# Altium schematic sheet Main.SchDoc: 203 Matrix - Core
size 320 x 193 mm; Revision: FE V1.0; SheetNumber: 3; SheetTotal: 4
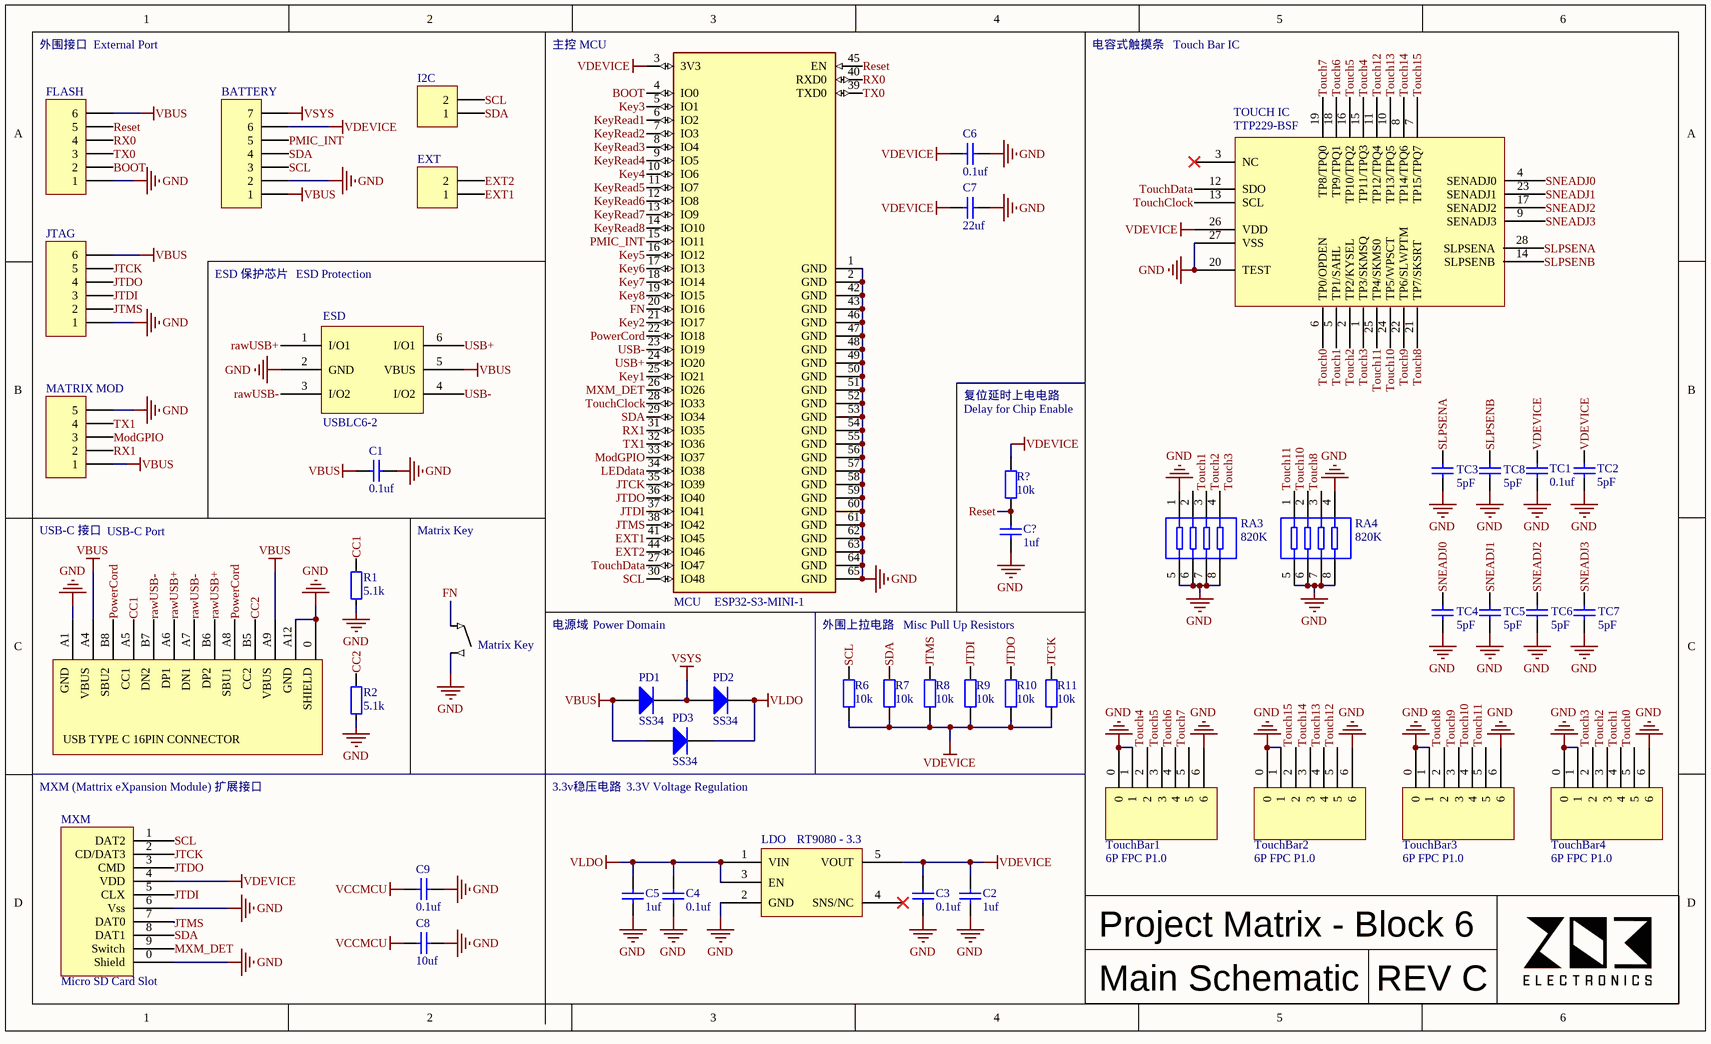
[diagram p0: Main.SchDoc]

## Parts
(Parts that share a designator on the sheet are numbered #1, #2 ... from top to bottom, then left to right.)
BATTERY  (no value)  [HDR1X7]
C1  value 0.1uf  [0603 CAP]  (hidden comment: MCU)
C2  value 1uf  [0603 CAP]  (hidden comment: MCU)
C3  value 0.1uf  [0603 CAP]  (hidden comment: MCU)
C4  value 0.1uf  [0603 CAP]  (hidden comment: MCU)
C5  value 1uf  [0603 CAP]  (hidden comment: MCU)
C6  value 0.1uf  [0603 CAP]  (hidden comment: MCU)
C7  value 22uf  [0603 CAP]  (hidden comment: LDO)
C8  value 10uf  [0603 CAP]  (hidden comment: MCU)
C9  value 0.1uf  [0603 CAP]  (hidden comment: MCU)
C?  value 1uf  [0603 CAP]  (hidden comment: LDO)
ESD  USBLC6-2  [SOT23-6L]
EXT  Header 2  [HDR1X2]  (value not drawn)
I2C  Header 2  [HDR1X2]  (value not drawn)
JTAG#1  FLASH  [HDR1X6]
JTAG#2  Interface to flash ESP  [HDR1X6]  (value not drawn)
LDO  RT9080 - 3.3  [SOT23-5]
Matrix_Key  Comment  [sw5x5]  (value not drawn)
MATRIX_MOD  MHDR1X5  [MHDR1X5]  (value not drawn)
MCU  ESP32-S3-MINI-1  [ESP32-S3-MINI-1]
MXM  Micro SD Card Slot  [TF Slot 2]
PD1  SS34  [SOD123]
PD2  SS34  [SOD123]
PD3  SS34  [SOD123]
R1  value 5.1k  [0603 res]  (hidden comment: MCU)
R2  value 5.1k  [0603 res]  (hidden comment: MCU)
R6  value 10k  [0603 res]  (hidden comment: MCU)
R7  value 10k  [0603 res]  (hidden comment: MCU)
R8  value 10k  [0603 res]  (hidden comment: MCU)
R9  value 10k  [0603 res]  (hidden comment: MCU)
R10  value 10k  [0603 res]  (hidden comment: MCU)
R11  value 10k  [0603 res]  (hidden comment: MCU)
R?  value 10k  [0603 res]  (hidden comment: MCU)
RA3  value 820K  [8P4R]  (hidden comment: Touch Bar)
RA4  value 820K  [8P4R]  (hidden comment: Touch Bar)
TC1  value 0.1uf  [0603 CAP]  (hidden comment: Touch Bar)
TC2  value 5pF  [0603 CAP]  (hidden comment: Touch Bar)
TC3  value 5pF  [0603 CAP]  (hidden comment: Touch Bar)
TC4  value 5pF  [0603 CAP]  (hidden comment: Touch Bar)
TC5  value 5pF  [0603 CAP]  (hidden comment: Touch Bar)
TC6  value 5pF  [0603 CAP]  (hidden comment: Touch Bar)
TC7  value 5pF  [0603 CAP]  (hidden comment: Touch Bar)
TC8  value 5pF  [0603 CAP]  (hidden comment: Touch Bar)
TOUCH_IC  TTP229-BSF  [SSOP-28]
TouchBar1  6P FPC P1.0  [6Pin FPC 1.0mm]
TouchBar2  6P FPC P1.0  [6Pin FPC 1.0mm]
TouchBar3  6P FPC P1.0  [6Pin FPC 1.0mm]
TouchBar4  6P FPC P1.0  [6Pin FPC 1.0mm]
USB-C  USBC 16PIN  [USBC short]  (value not drawn)

## Nets
GND: BATTERY.2 C1.1 C2.1 C3.1 C4.2 C5.2 C6.1 C7.1 C8.2 C9.2 C?.2 ESD.2(GND) JTAG#1.1 JTAG#2.1 LDO.2(GND) Matrix_Key.2(Out) MATRIX_MOD.5 MCU.1(GND) MCU.2(GND) MCU.42(GND) MCU.43(GND) MCU.46(GND) MCU.47(GND) MCU.48(GND) MCU.49(GND) MCU.50(GND) MCU.51(GND) MCU.52(GND) MCU.53(GND) MCU.54(GND) MCU.55(GND) MCU.56(GND) MCU.57(GND) MCU.58(GND) MCU.59(GND) MCU.60(GND) MCU.61(GND) MCU.62(GND) MCU.63(GND) MCU.64(GND) MCU.65(GND) MXM.0(Shield) MXM.6(Vss) R1.2 R2.1 RA3.1 RA3.5 RA3.6 RA3.7 RA3.8 RA4.4 RA4.5 RA4.6 RA4.7 RA4.8 TC1.1 TC2.1 TC3.1 TC4.1 TC5.1 TC6.1 TC7.1 TC8.1 TOUCH_IC.20(TEST) TOUCH_IC.27(VSS) TouchBar1.0 TouchBar1.1 TouchBar1.6 TouchBar2.0 TouchBar2.1 TouchBar2.6 TouchBar3.0 TouchBar3.1 TouchBar3.6 TouchBar4.0 TouchBar4.1 TouchBar4.6 USB-C.0 USB-C.A1 USB-C.A12
VBUS: BATTERY.1 C1.2 ESD.5(VBUS) JTAG#1.6 JTAG#2.6 MATRIX_MOD.1 PD1.1(A) PD3.1(A) USB-C.A4 USB-C.A9
VCCMCU: C8.1 C9.1
VDEVICE: BATTERY.6 C2.2 C3.2 C6.2 C7.2 LDO.5(VOUT) MCU.3(3V3) MXM.4(VDD) R6.1 R7.1 R8.1 R9.1 R10.1 R11.1 R?.1 TC1.2 TC2.2 TOUCH_IC.26(VDD)
VLDO: C4.1 C5.1 LDO.1(VIN) LDO.3(EN) PD2.2(K) PD3.2(K)
VSYS: BATTERY.7 PD1.2(K) PD2.1(A)
BOOT: JTAG#1.2 MCU.4(IO0)
CC1: R1.1 USB-C.A5
CC2: R2.2 USB-C.B5
EXT1: EXT.1 MCU.41(IO45)
EXT2: EXT.2 MCU.44(IO46)
FN: Matrix_Key.1 MCU.20(IO16)
JTCK: JTAG#2.5 MCU.35(IO39) MXM.2(CD/DAT3) R11.2
JTDI: JTAG#2.3 MCU.37(IO41) MXM.5(CLX) R9.2
JTDO: JTAG#2.4 MCU.36(IO40) MXM.3(CMD) R10.2
JTMS: JTAG#2.2 MCU.38(IO42) MXM.7(DAT0) R8.2
Key1: MCU.25(IO21)
Key2: MCU.21(IO17)
Key3: MCU.5(IO1)
Key4: MCU.10(IO6)
Key5: MCU.16(IO12)
Key6: MCU.17(IO13)
Key7: MCU.18(IO14)
Key8: MCU.19(IO15)
KeyRead1: MCU.6(IO2)
KeyRead2: MCU.7(IO3)
KeyRead3: MCU.8(IO4)
KeyRead4: MCU.9(IO5)
KeyRead5: MCU.11(IO7)
KeyRead6: MCU.12(IO8)
KeyRead7: MCU.13(IO9)
KeyRead8: MCU.14(IO10)
LEDdata: MCU.34(IO38)
ModGPIO: MATRIX_MOD.3 MCU.33(IO37)
MXM_DET: MCU.26(IO26) MXM.9(Switch)
PMIC_INT: BATTERY.5 MCU.15(IO11)
PowerCord: MCU.22(IO18) USB-C.A8 USB-C.B8
rawUSB+: ESD.1(I/O1) USB-C.A6 USB-C.B6
rawUSB-: ESD.3(I/O2) USB-C.A7 USB-C.B7
Reset: C?.1 JTAG#1.5 MCU.45(EN) R?.2
RX0: JTAG#1.4 MCU.40(RXD0)
RX1: MATRIX_MOD.2 MCU.31(IO35)
SCL: BATTERY.3 I2C.2 MCU.30(IO48) MXM.1(DAT2) R6.2
SDA: BATTERY.4 I2C.1 MCU.29(IO34) MXM.8(DAT1) R7.2
SLPSENA: TC3.2 TOUCH_IC.28(SLPSENA)
SLPSENB: TC8.2 TOUCH_IC.14(SLPSENB)
SNEADJ0: TC4.2 TOUCH_IC.4(SENADJ0)
SNEADJ1: TC5.2 TOUCH_IC.23(SENADJ1)
SNEADJ2: TC6.2 TOUCH_IC.17(SENADJ2)
SNEADJ3: TC7.2 TOUCH_IC.9(SENADJ3)
Touch0: TOUCH_IC.6(TP0/OPDEN) TouchBar4.5
Touch1: RA3.2 TOUCH_IC.5(TP1/SAHL) TouchBar4.4
Touch2: RA3.3 TOUCH_IC.2(TP2/KYSEL) TouchBar4.3
Touch3: RA3.4 TOUCH_IC.1(TP3/SKMSQ) TouchBar4.2
Touch4: TOUCH_IC.15(TP11/TPQ3) TouchBar1.2
Touch5: TOUCH_IC.16(TP10/TPQ2) TouchBar1.3
Touch6: TOUCH_IC.18(TP9/TPQ1) TouchBar1.4
Touch7: TOUCH_IC.19(TP8/TPQ0) TouchBar1.5
Touch8: RA4.3 TOUCH_IC.21(TP7/SKSRT) TouchBar3.2
Touch9: TOUCH_IC.22(TP6/SLWPTM) TouchBar3.3
Touch10: RA4.2 TOUCH_IC.24(TP5/WPSCT) TouchBar3.4
Touch11: RA4.1 TOUCH_IC.25(TP4/SKMS0) TouchBar3.5
Touch12: TOUCH_IC.11(TP12/TPQ4) TouchBar2.5
Touch13: TOUCH_IC.10(TP13/TPQ5) TouchBar2.4
Touch14: TOUCH_IC.8(TP14/TPQ6) TouchBar2.3
Touch15: TOUCH_IC.7(TP15/TPQ7) TouchBar2.2
TouchClock: MCU.28(IO33) TOUCH_IC.13(SCL)
TouchData: MCU.27(IO47) TOUCH_IC.12(SDO)
TX0: JTAG#1.3 MCU.39(TXD0)
TX1: MATRIX_MOD.4 MCU.32(IO36)
USB+: ESD.6(I/O1) MCU.24(IO20)
USB-: ESD.4(I/O2) MCU.23(IO19)

Not connected (* = marked no-connect by the designer): LDO 4(SNS/NC)*; TOUCH_IC 3(NC)*

## Notes on the sheet
- 外围接口
- External Port
- 主控 MCU
- 电容式触摸条
- Touch Bar IC
- ESD 保护芯片
- ESD Protection
- 复位延时上电电路
- Delay for Chip Enable
- USB-C 接口
- USB-C Port
- Matrix Key
- 电源域
- (near MCU) Power Domain
- 外围上拉电路
- Misc Pull Up Resistors
- (near MXM) MXM (Mattrix eXpansion Module) 扩展接口
- 3.3v稳压电路
- (near PD3) 3.3V Voltage Regulation
- Project Matrix - Block 6
- Main Schematic
- REV C
- (in symbol USBC 16PIN) GND; VBUS; SBU2; CC1; DN2; DP1; DN1; DP2; SBU1; CC2; SHIELD; USB TYPE C 16PIN CONNECTOR

## Library data of the parts
BATTERY = Header 7: Header, 7-Pin; LatestRevisionDate: 17-Jul-2002; LatestRevisionNote: Re-released for DXP Platform.; Publisher: Altium Limited
C1-C9 C? = Cap: Published: 8-Jun-2000; LatestRevisionDate: 17-Jul-2002; LatestRevisionNote: Re-released for DXP Platform.; PackageReference: RAD-0.3; Publisher: Altium Limited; PackageDescription: Radial Cap, Thru-Hole; 2 Leads; 0.3 in Pin Spacing
EXT I2C = Header 2: Header, 2-Pin; LatestRevisionDate: 17-Jul-2002; LatestRevisionNote: Re-released for DXP Platform.; Publisher: Altium Limited
JTAG#1 JTAG#2 = MHDR1X6: Header, 6-Pin; LatestRevisionDate: 17-Jul-2002; LatestRevisionNote: Re-released for DXP Platform.; Publisher: Altium Limited
LDO = RT9080
Matrix_Key = SW: System
MATRIX_MOD = MHDR1X5: MCU; LatestRevisionDate: 17-Jul-2002; LatestRevisionNote: Re-released for DXP Platform.; Publisher: Altium Limited
MXM = SD Card with Switch
PD1-PD3 = Diode 1N4934: 1 Amp Fast Recovery Rectifier; Published: 8-Jun-2000; LatestRevisionDate: 17-Jul-2002; LatestRevisionNote: Re-released for DXP Platform.; DatasheetVersion: 1999; PackageVersion: Aug-1999; PackageReference: DO-41; Publisher: Altium Limited; PackageDescription: Diode, Axial; Body 5.2 x 2.7 mm (LxDia. max), Lead Dia. 0.86 mm (max); Code_JEDEC: DO-204-AL; ComponentLink1Description: Manufacturer Link; ComponentLink1URL: http://www.fairchildsemi.com/; ComponentLink2Description: Datasheet; ComponentLink2URL: http://www.fairchildsemi.com/ds/1N%2F1N4934.pdf
R1 R2 R6-R11 R? = Res2: Published: 8-Jun-2000; LatestRevisionDate: 17-Jul-2002; LatestRevisionNote: Re-released for DXP Platform.; PackageReference: AXIAL-0.4; Publisher: Altium Limited; PackageDescription: Axial Device, Thru-Hole; 2 Leads; 0.4 in Pin Spacing
RA3 RA4 = 4R8P Resistor
TC1 TC2 = Cap: Needs to be NR0; Published: 8-Jun-2000; LatestRevisionDate: 17-Jul-2002; LatestRevisionNote: Re-released for DXP Platform.; PackageReference: RAD-0.3; Publisher: Altium Limited; PackageDescription: Radial Cap, Thru-Hole; 2 Leads; 0.3 in Pin Spacing
TC3-TC8 = Cap: 需要用NR0材料 Needs to be NR0; Published: 8-Jun-2000; LatestRevisionDate: 17-Jul-2002; LatestRevisionNote: Re-released for DXP Platform.; PackageReference: RAD-0.3; Publisher: Altium Limited; PackageDescription: Radial Cap, Thru-Hole; 2 Leads; 0.3 in Pin Spacing
TouchBar1-TouchBar4 = 6 pin fpc
USB-C = USBC 16PIN: MCU; Value: 沉板1.6mm D6.5
TOUCH_IC = TTP229-BSF: Value: TTP229-BSF